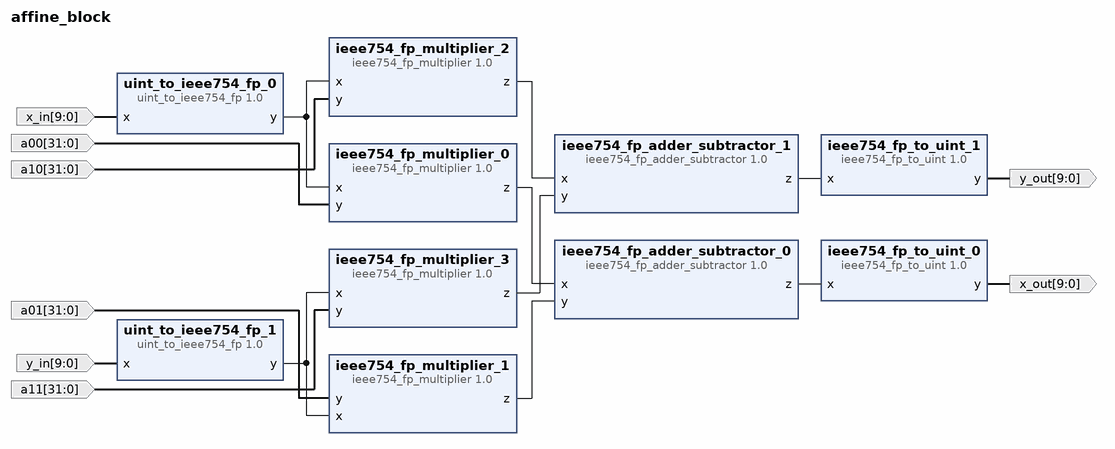
[diagram p0: block diagram of the top level]
# Vivado block design affine_block, xc7z010clg400-1, Vivado 2016.4
create_bd_design affine_block

create_bd_port -dir I -from 9 -to 0 x_in
create_bd_port -dir I -from 9 -to 0 y_in
create_bd_port -dir I -from 31 -to 0 a00
create_bd_port -dir I -from 31 -to 0 a01
create_bd_port -dir I -from 31 -to 0 a10
create_bd_port -dir I -from 31 -to 0 a11
create_bd_port -dir O -from 9 -to 0 x_out
create_bd_port -dir O -from 9 -to 0 y_out

create_bd_cell -type ip -vlnv xilinx.com:user:uint_to_ieee754_fp:1.0 uint_to_ieee754_fp_0
create_bd_cell -type ip -vlnv xilinx.com:user:uint_to_ieee754_fp:1.0 uint_to_ieee754_fp_1
create_bd_cell -type ip -vlnv xilinx.com:user:ieee754_fp_multiplier:1.0 ieee754_fp_multiplier_0
create_bd_cell -type ip -vlnv xilinx.com:user:ieee754_fp_multiplier:1.0 ieee754_fp_multiplier_1
create_bd_cell -type ip -vlnv xilinx.com:user:ieee754_fp_multiplier:1.0 ieee754_fp_multiplier_2
create_bd_cell -type ip -vlnv xilinx.com:user:ieee754_fp_multiplier:1.0 ieee754_fp_multiplier_3
create_bd_cell -type ip -vlnv xilinx.com:user:ieee754_fp_adder_subtractor:1.0 ieee754_fp_adder_subtractor_0
create_bd_cell -type ip -vlnv xilinx.com:user:ieee754_fp_adder_subtractor:1.0 ieee754_fp_adder_subtractor_1
create_bd_cell -type ip -vlnv xilinx.com:user:ieee754_fp_to_uint:1.0 ieee754_fp_to_uint_0
create_bd_cell -type ip -vlnv xilinx.com:user:ieee754_fp_to_uint:1.0 ieee754_fp_to_uint_1

# ---- connections ----

connect_bd_net -net x_1 [get_bd_ports x_in] [get_bd_pins uint_to_ieee754_fp_0/x]
connect_bd_net -net x_2 [get_bd_ports y_in] [get_bd_pins uint_to_ieee754_fp_1/x]
connect_bd_net -net y_1 [get_bd_ports a00] [get_bd_pins ieee754_fp_multiplier_0/y]
connect_bd_net -net y_2 [get_bd_ports a01] [get_bd_pins ieee754_fp_multiplier_1/y]
connect_bd_net -net y_3 [get_bd_ports a10] [get_bd_pins ieee754_fp_multiplier_2/y]
connect_bd_net -net y_4 [get_bd_ports a11] [get_bd_pins ieee754_fp_multiplier_3/y]
connect_bd_net [get_bd_pins uint_to_ieee754_fp_0/y] [get_bd_pins ieee754_fp_multiplier_0/x] [get_bd_pins ieee754_fp_multiplier_2/x]
connect_bd_net [get_bd_pins uint_to_ieee754_fp_1/y] [get_bd_pins ieee754_fp_multiplier_1/x] [get_bd_pins ieee754_fp_multiplier_3/x]
connect_bd_net [get_bd_pins ieee754_fp_multiplier_0/z] [get_bd_pins ieee754_fp_adder_subtractor_0/x]
connect_bd_net [get_bd_pins ieee754_fp_multiplier_1/z] [get_bd_pins ieee754_fp_adder_subtractor_0/y]
connect_bd_net [get_bd_pins ieee754_fp_multiplier_2/z] [get_bd_pins ieee754_fp_adder_subtractor_1/x]
connect_bd_net [get_bd_pins ieee754_fp_multiplier_3/z] [get_bd_pins ieee754_fp_adder_subtractor_1/y]
connect_bd_net [get_bd_pins ieee754_fp_adder_subtractor_0/z] [get_bd_pins ieee754_fp_to_uint_0/x]
connect_bd_net [get_bd_pins ieee754_fp_adder_subtractor_1/z] [get_bd_pins ieee754_fp_to_uint_1/x]
connect_bd_net [get_bd_pins ieee754_fp_to_uint_0/y] [get_bd_ports x_out]
connect_bd_net [get_bd_pins ieee754_fp_to_uint_1/y] [get_bd_ports y_out]

validate_bd_design
save_bd_design
